# EAGLE design lvpsu (EAGLE 7.5.0)
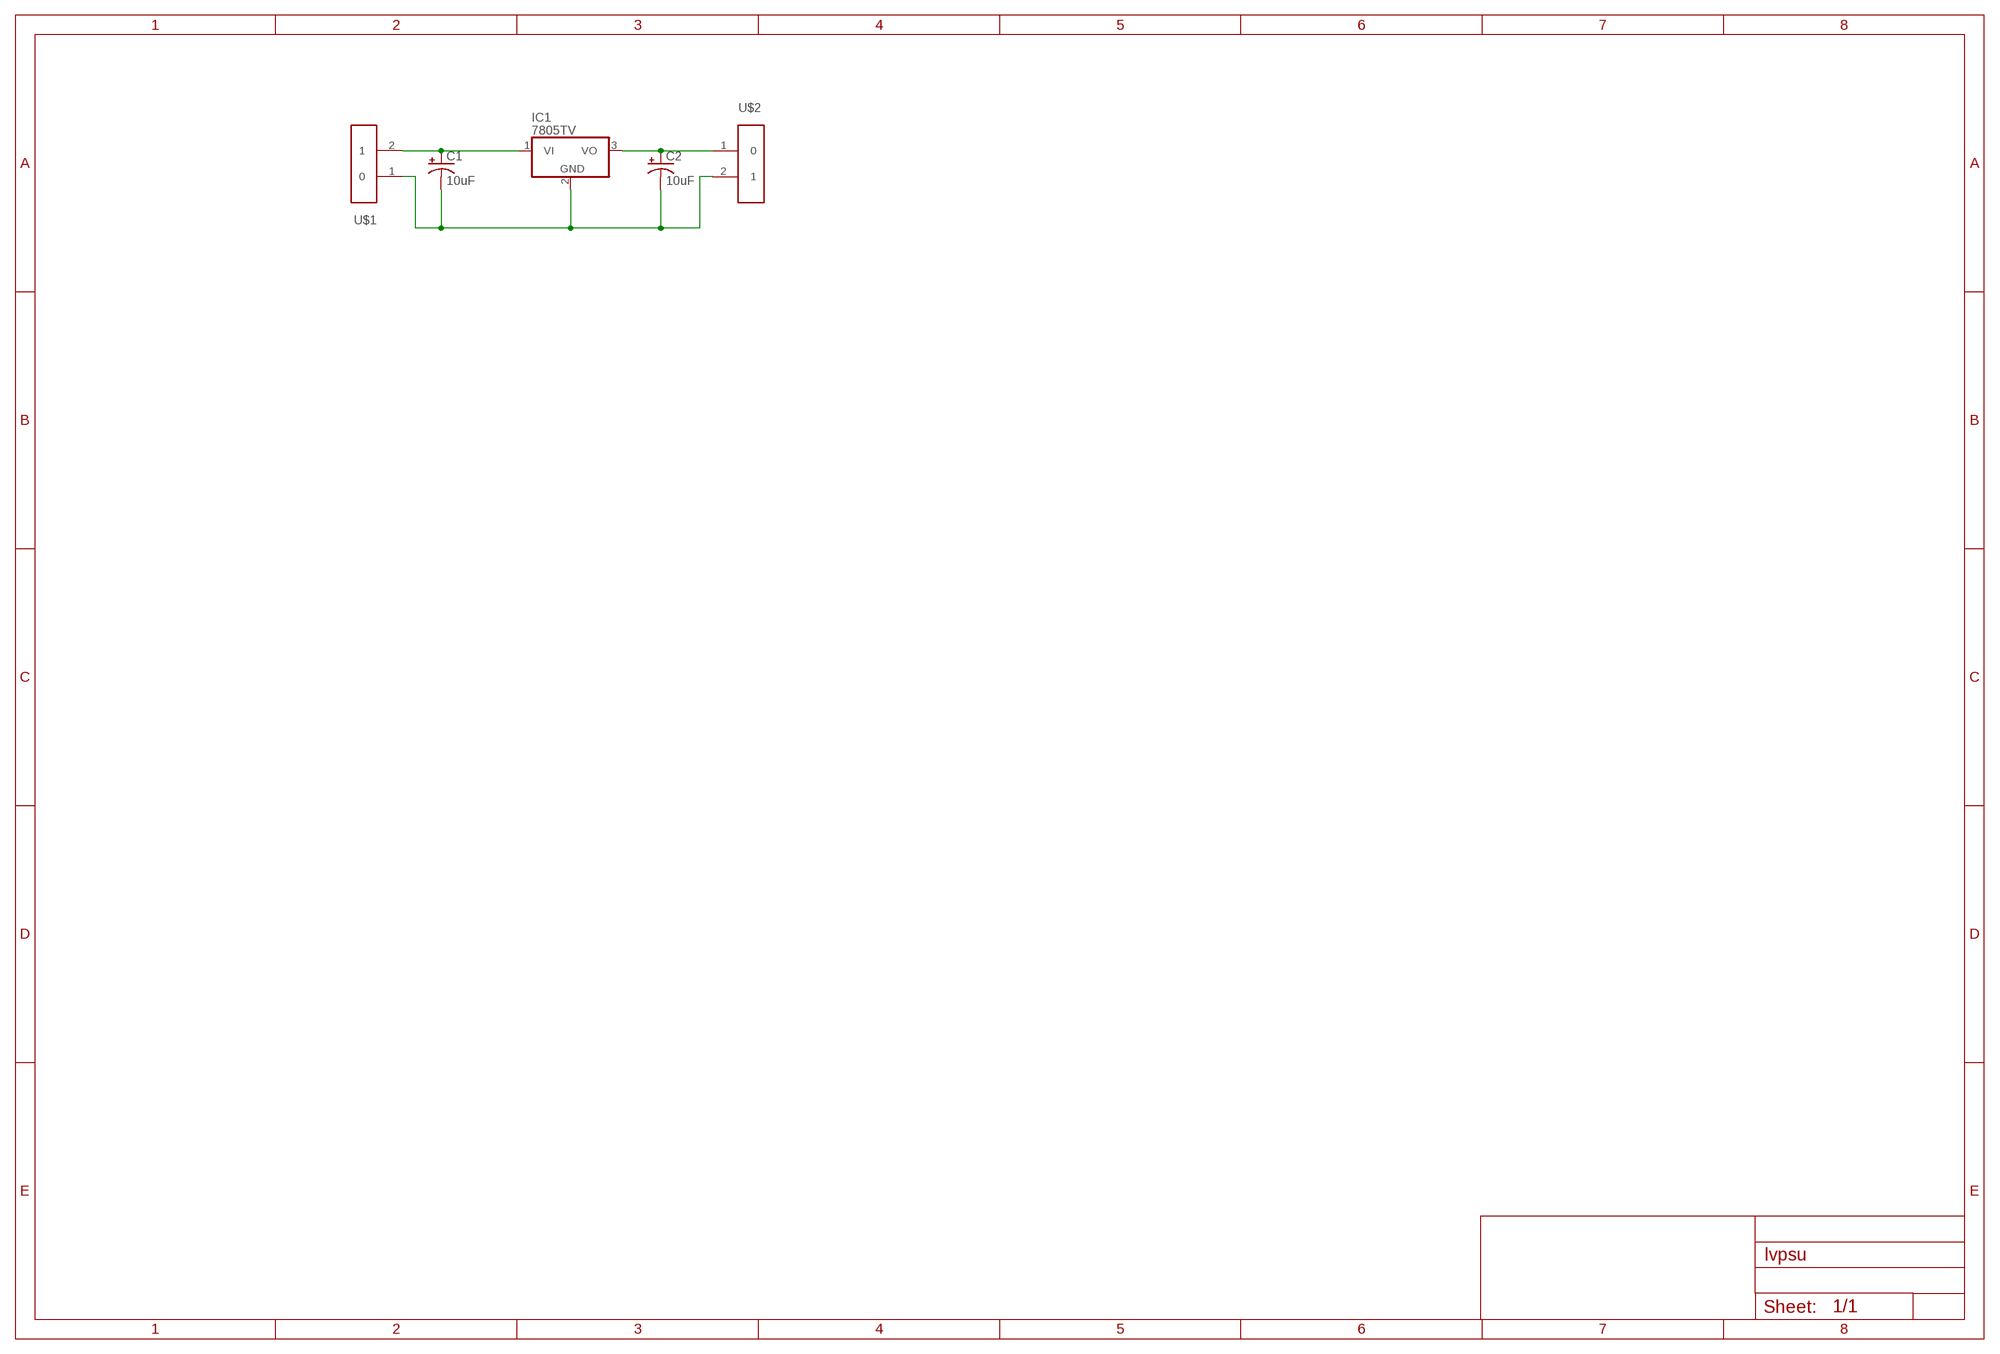
[diagram p0: schematic, sheet 1]

## Parts
C1  10uF  CPOL-USE2.5-5  [E2,5-5]
C2  10uF  CPOL-USE2.5-5  [E2,5-5]
IC1  7805TV  [TO220V]
U$1  ED2609  [ED2609]
U$2  ED2609  [ED2609]

## Nets
N$1: C1.+ IC1.1(VI) U$1.2
N$2: C2.+ IC1.3(VO) U$2.1
N$3: C1.- C2.- IC1.2(GND) U$1.1 U$2.2

## Library data of the parts
C1 C2 = rcl:CPOL-US: POLARIZED CAPACITOR, American symbol
IC1 = linear:78*: Positive VOLTAGE REGULATOR Source: http://cache.national.com/ds/LM/LM78L05.pdf http://www.fairchildsemi.com/ds/LM/LM7805.pdf
U$1 U$2 = muon-tube:ED2609

## Board
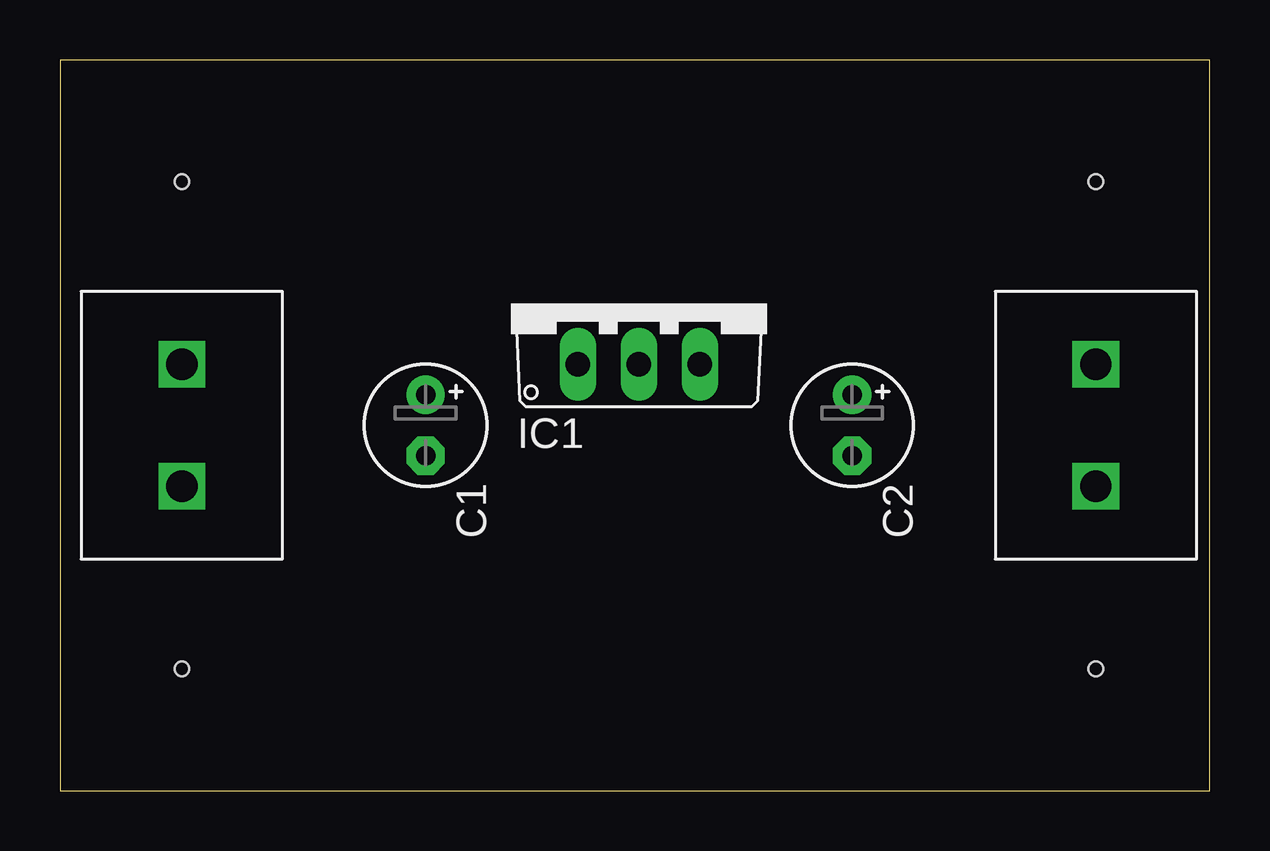
[diagram p1: board, top side]
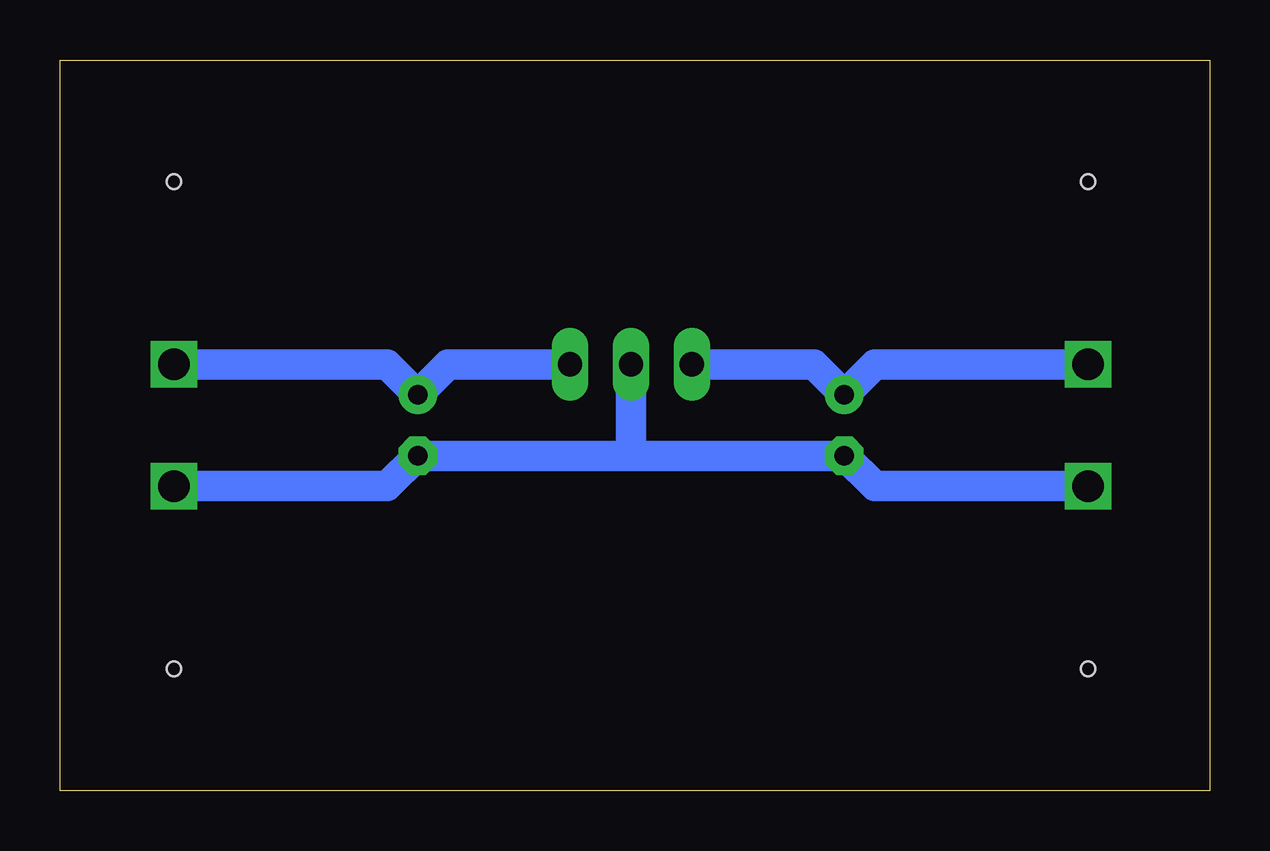
[diagram p2: board, bottom side, seen from below]

Size 47.93 x 30.47 mm. Coordinates in mm from the lower left corner, seen from the top.
Outline: 0,0 47.93,0 47.93,30.47 0,30.47 0,0
Copper layers (1*16): Top 0.035mm / dielectric 1.5mm / Bottom 0.035mm
Design rules "default": minimum track width 10mil, minimum drill 24mil, track to track 8mil, track to pad 8mil, pad to pad 8mil, via to via 8mil, smd to smd 8mil, copper to edge 40mil, drill to drill 8mil, minimum pad ring 10mil, minimum via ring 8mil, stop-mask expansion 4mil, vias tented up to drill 0mil, thermal gap 10mil
Holes 0.6 mm at 5.08,5.08 43.18,5.08 43.18,25.4 5.08,25.4

### Footprints (pad centres in the part's own frame; a part is rotated, then mirrored left to right if it is on the bottom)
E2,5-5 = drill 0.813 pad 1.6: + -1.27,0 | drill 0.813 pad 1.6 octagon: - 1.27,0
TO220V = drill 1.016 long: 1 -2.54,-2.54; 2 0,-2.54; 3 2.54,-2.54
ED2609 = drill 1.3 square: 1 0,0; 2 5.08,0

### Placement (x,y rotation side)
C1  15.24,15.24 270 top
C2  33.02,15.24 270 top
IC1  24.13,20.32 0 top
U$1  5.08,12.7 90 top
U$2  43.18,17.78 270 top

### Tracks (layer width: path | path; a pad name or v marks a point on that pad's centre or on a via)
N$1
  Bottom 1.27: U$1.2 13.97,17.78 C1.+ 16.51,17.78 IC1.1
N$2
  Bottom 1.27: IC1.3 31.75,17.78 C2.+ 34.29,17.78 U$2.1
N$3
  Bottom 1.27: IC1.2 24.13,13.97 | 24.13,13.97 C1.- 13.97,12.7 U$1.1 | 24.13,13.97 C2.- 34.29,12.7 U$2.2